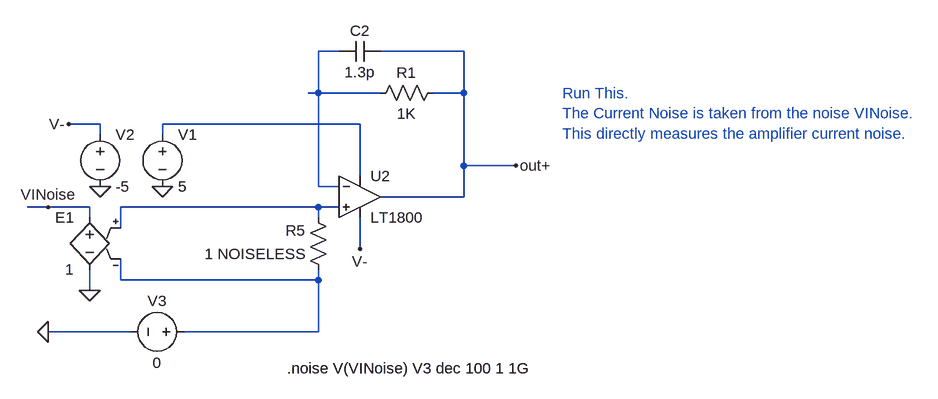
[diagram p0: schematic LT1800_in1.asc]
LT1800_in1.asc, the LTspice schematic file:
Version 4
SHEET 1 1064 680
WIRE 48 32 16 32
WIRE 240 32 112 32
WIRE 16 96 16 32
WIRE 16 96 0 96
WIRE 112 96 16 96
WIRE 240 96 240 32
WIRE 240 96 192 96
WIRE -320 144 -368 144
WIRE 80 144 -224 144
WIRE -320 160 -320 144
WIRE -224 160 -224 144
WIRE 240 208 240 96
WIRE 320 208 240 208
WIRE 80 224 80 144
WIRE 16 240 16 96
WIRE 48 240 16 240
WIRE 240 256 240 208
WIRE 240 256 112 256
WIRE -400 272 -432 272
WIRE -336 272 -400 272
WIRE 16 272 -288 272
WIRE 48 272 16 272
WIRE -336 288 -336 272
WIRE 16 288 16 272
WIRE -288 304 -288 272
WIRE 80 336 80 288
WIRE -288 384 -288 352
WIRE 16 384 16 368
WIRE 16 384 -288 384
WIRE -336 400 -336 368
WIRE -272 464 -400 464
WIRE 16 464 16 384
WIRE 16 464 -192 464
FLAG -224 240 0
FLAG 320 208 out+
FLAG -336 400 0
FLAG -400 272 VINoise
FLAG -320 240 0
FLAG -368 144 V-
FLAG 80 336 V-
FLAG -400 464 0
SYMBOL voltage -224 144 R0
WINDOW 123 0 0 Left 0
WINDOW 39 0 0 Left 0
SYMATTR InstName V1
SYMATTR Value 5
SYMBOL res 208 80 R90
WINDOW 0 0 56 VBottom 2
WINDOW 3 32 56 VTop 2
SYMATTR InstName R1
SYMATTR Value 1K
SYMBOL cap 112 16 R90
WINDOW 0 0 32 VBottom 2
WINDOW 3 32 32 VTop 2
SYMATTR InstName C2
SYMATTR Value 1.3p
SYMBOL res 32 384 R180
WINDOW 0 36 76 Left 2
WINDOW 3 36 40 Left 2
SYMATTR InstName R5
SYMATTR Value 1 NOISELESS
SYMBOL e -336 272 M0
SYMATTR InstName E1
SYMATTR Value 1
SYMBOL voltage -320 144 R0
WINDOW 123 0 0 Left 0
WINDOW 39 0 0 Left 0
SYMATTR InstName V2
SYMATTR Value -5
SYMBOL voltage -176 464 R90
WINDOW 0 -32 56 VBottom 2
WINDOW 3 32 56 VTop 2
WINDOW 123 0 0 Left 0
WINDOW 39 0 0 Left 0
SYMATTR InstName V3
SYMATTR Value 0
SYMBOL Opamps\\LT1800 80 192 R0
SYMATTR InstName U2
TEXT 392 96 Left 2 ;Run This.\nThe Current Noise is taken from the noise VINoise.\nThis directly measures the amplifier current noise.
TEXT -32 520 Left 2 !.noise V(VINoise) V3 dec 100 1 1G

The netlist it stands for:
* LT1800_in1.asc
V1 N002 0 5
R1 out+ N001 1K
C2 out+ N001 1.3p
R5 N004 N003 1 NOISELESS
E1 VINoise 0 N003 N004 1
V2 V- 0 -5
V3 N004 0 0
XU2 N003 N001 N002 V- out+ LT1800  ; pins In+ In- V+ V- OUT
* Run This.
* The Current Noise is taken from the noise VINoise.
* This directly measures the amplifier current noise.
.noise V(VINoise) V3 dec 100 1 1G
.backanno
.end